# Altium schematic sheet Title.SchDoc
size A4
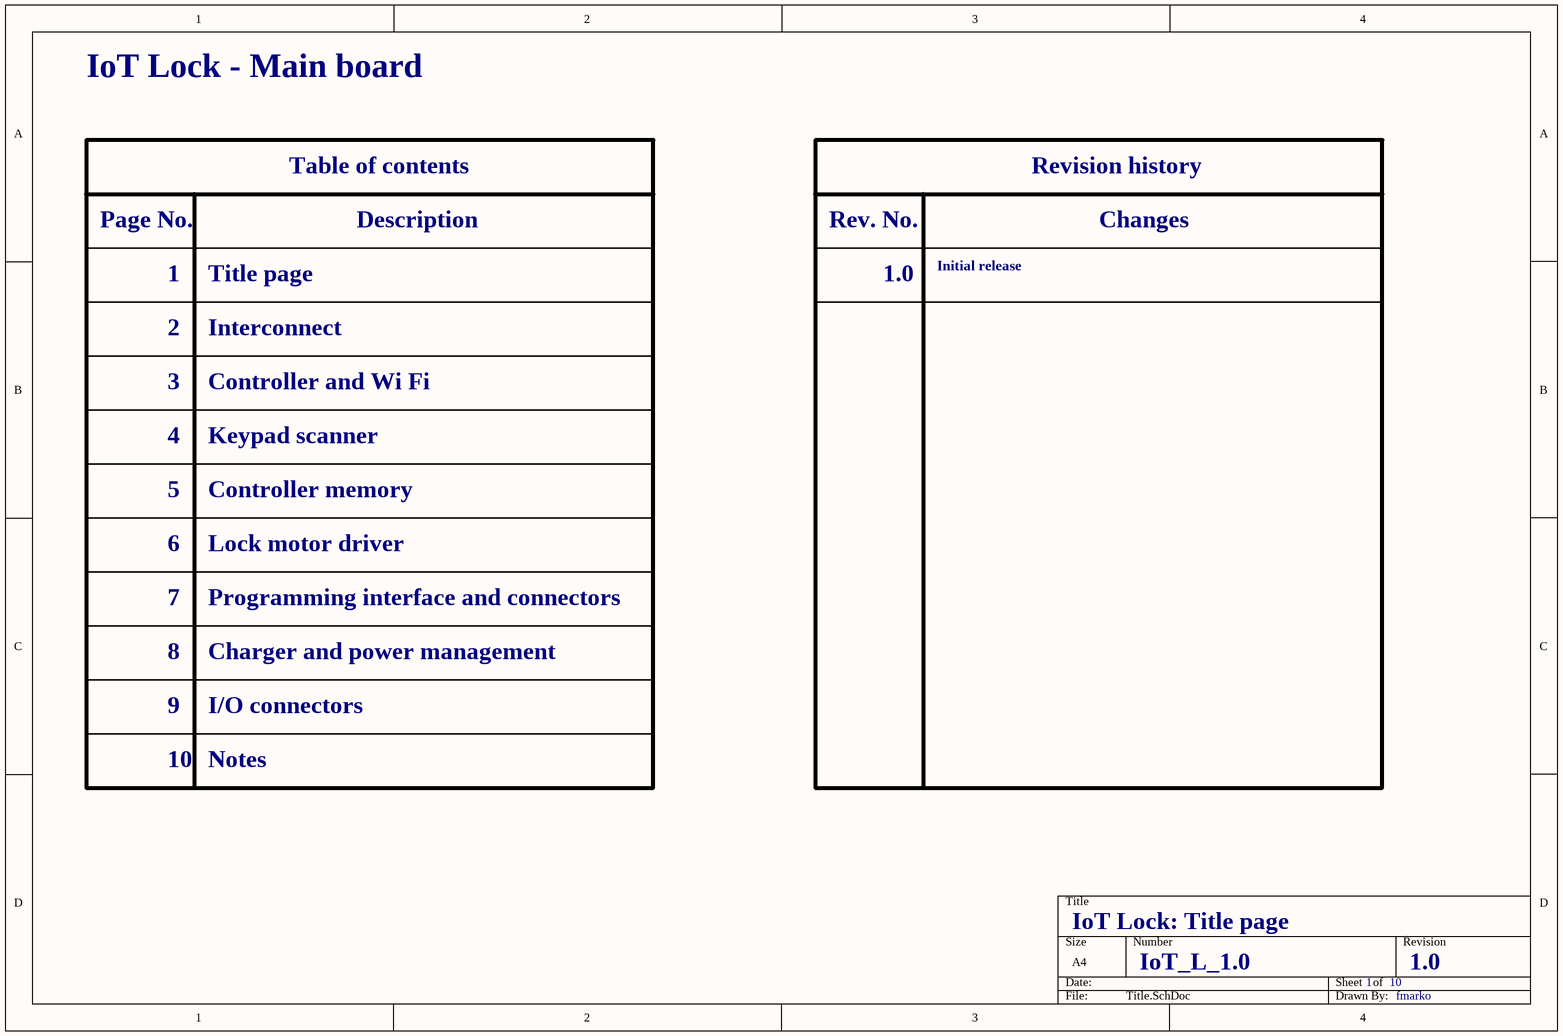
[diagram p0: Title.SchDoc]

## Notes on the sheet
- IoT Lock - Main board
- Table of contents
- Revision history
- Page No.
- Description
- Rev. No.
- Changes
- 1
- Title page
- 1.0
- Initial release
- 2
- Interconnect
- 3
- 4
- Controller and Wi Fi
- Keypad scanner
- 5
- Controller memory
- 6
- Lock motor driver
- 7
- Programming interface and connectors
- 8
- 9
- Charger and power management
- I/O connectors
- 10
- Notes
- IoT Lock: Title page
- IoT_L_1.0
- fmarko